# Altium schematic sheet PWR_IN.SchDoc
size A4
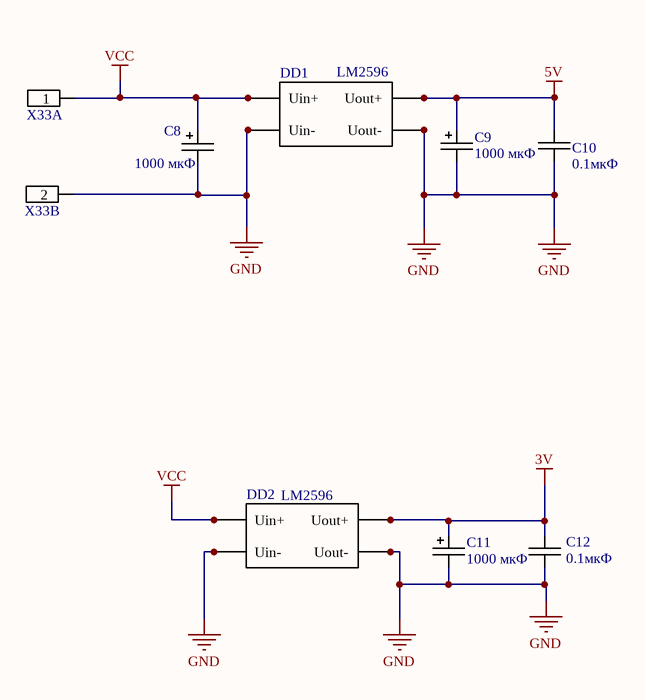
[diagram p0: PWR_IN.SchDoc]

## Parts
C8  1000 мкФ  [C_10x5]
C9  1000 мкФ  [C_10x5]
C10  0.1мкФ  [C_1206]
C11  1000 мкФ  [C_10x5]
C12  0.1мкФ  [C_1206]
DD1  LM2596  [LM2596]
DD2  LM2596  [LM2596]
X33  DG508V-02  [DG508V-02]  (value not drawn)  (parts A,B of 2)

## Nets
3V: C11.1 C12.1 DD2.5(Uout+) DD2.6(Uout+)
5V: C9.1 C10.1 DD1.5(Uout+) DD1.6(Uout+)
GND: C8.2 C9.2 C10.2 C11.2 C12.2 DD1.3(Uin-) DD1.4(Uin-) DD1.7(Uout-) DD1.8(Uout-) DD2.3(Uin-) DD2.4(Uin-) DD2.7(Uout-) DD2.8(Uout-) X33.2
VCC: C8.1 DD1.1(Uin+) DD1.2(Uin+) DD2.1(Uin+) DD2.2(Uin+) X33.1

## Library data of the parts
C8 C9 C11 = Конденсатор 25х12.5: К50-35; Tolerance: 20%; Type: Электролитический конденсатор; Life: 2000 часов; Name: К50-35; Value: 1000 мкФ; Mounting: в отверстие
C10 C12 = Конденсатор 1210: SMD; Name: 1210; Voltage: 50B; Tolerance: 10%; Type: Конденсатор ЧИП; Value: 0.1мкФ; Mounting: SMD
DD1 DD2 = LM2596: Блок питания; Mounting: в отверстие; Name: LM2596
X33 = DG508V-02: клеммник винтовой 2к.,5.08мм; Analog: MKDS 2/3; Name: DG508V-02; Type: шаг 5,08 мм; Mounting: в отверстие